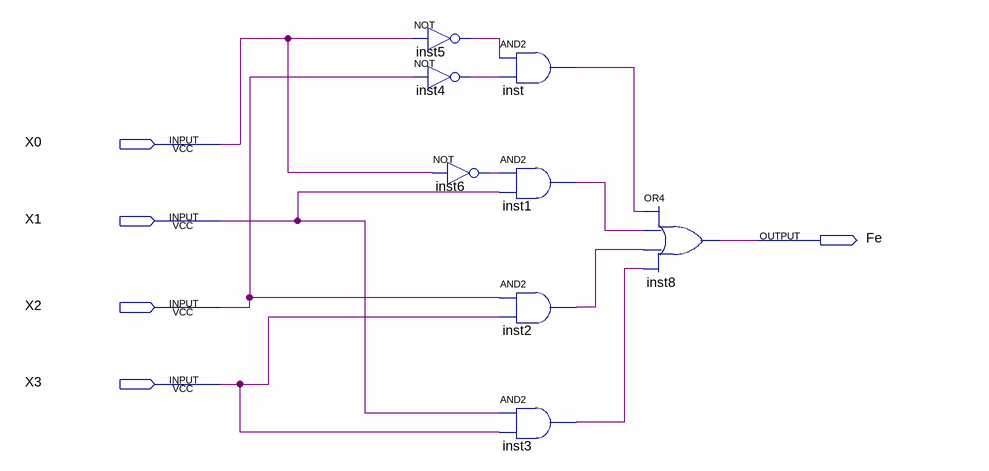
[diagram p0: schematic sheet]
// Quartus schematic Segmento5.bdf as structural Verilog: 8 symbols, 5 pins
module Segmento5 (
  input  X0,
  input  X1,
  input  X2,
  input  X3,
  output Fe
);

  wire inst1_out, inst2_out, inst3_out, inst4_out, inst5_out, inst6_out, inst_out;

  not inst5 (inst5_out, X0);
  not inst4 (inst4_out, X2);
  not inst6 (inst6_out, X0);
  and inst (inst_out, inst5_out, inst4_out);
  and inst1 (inst1_out, inst6_out, X1);
  and inst2 (inst2_out, X2, X3);
  and inst3 (inst3_out, X1, X3);
  or inst8 (Fe, inst_out, inst1_out, inst2_out, inst3_out);
endmodule
